# Altium schematic sheet cSLIM-shield.SchDoc
size 297 x 210 mm; SheetNumber: 1; SheetTotal: 12
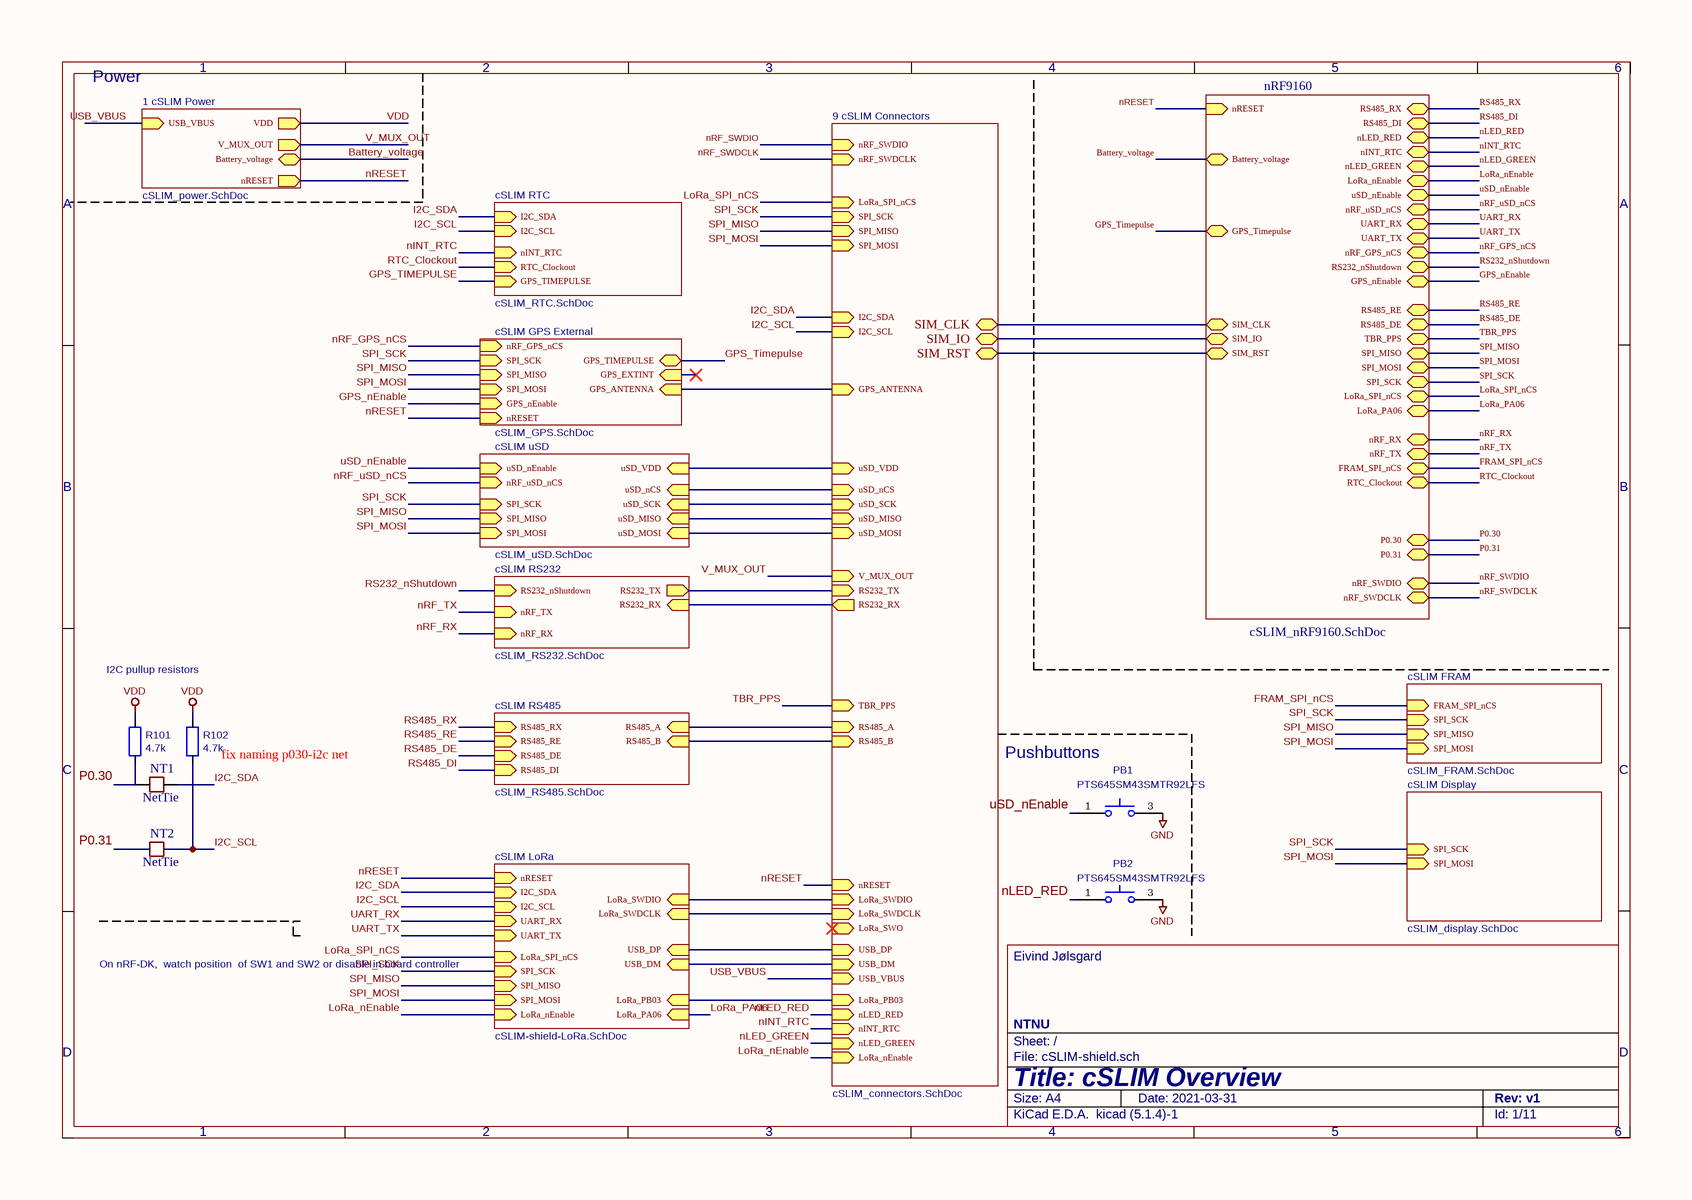
[diagram p0: cSLIM-shield.SchDoc]

## Parts
NT1  NetTie  [NETTIE_FP]
NT2  NetTie  [NETTIE_FP]
PB1  value PTS645SM43SMTR92LFS  [PTS645(SMT)]
PB2  value PTS645SM43SMTR92LFS  [PTS645(SMT)]
R101  4.7k  [RESC1608X55N]
R102  4.7k  [RESC1608X55N]

## Sub-sheets
1 cSLIM Power = cSLIM_power.SchDoc: nRESET (out), VDD (out), USB_VBUS (in), V_MUX_OUT (out), Battery_voltage (bidir)
9 cSLIM Connectors = cSLIM_connectors.SchDoc: RS485_A (in), RS485_B (in), TBR_PPS (in), V_MUX_OUT (in), RS232_TX (in), RS232_RX (out), LoRa_SWDIO (in), LoRa_SWDCLK (in), LoRa_SWO (in), nRESET (in), USB_DM (in), USB_DP (in), USB_VBUS (in), uSD_nCS (in), uSD_MOSI (in), uSD_SCK (in), uSD_MISO (in), uSD_VDD (in), LoRa_SPI_nCS (in), SPI_SCK (in), SPI_MOSI (in), SPI_MISO (in), I2C_SCL (in), I2C_SDA (in), nLED_RED (in), nINT_RTC (in), nLED_GREEN (in), LoRa_nEnable (in), GPS_ANTENNA (in), LoRa_PB03 (in), nRF_SWDIO (in), nRF_SWDCLK (in), SIM_CLK (bidir), SIM_RST (bidir), SIM_IO (bidir)
cSLIM Display = cSLIM_display.SchDoc: SPI_SCK (in), SPI_MOSI (in)
cSLIM FRAM = cSLIM_FRAM.SchDoc: SPI_MISO (in), FRAM_SPI_nCS (in), SPI_SCK (in), SPI_MOSI (in)
cSLIM GPS External = cSLIM_GPS.SchDoc: nRF_GPS_nCS (in), GPS_nEnable (in), SPI_MISO (in), SPI_MOSI (in), SPI_SCK (in), GPS_TIMEPULSE (bidir), GPS_EXTINT (in), nRESET (in), GPS_ANTENNA (in)
cSLIM LoRa = cSLIM-shield-LoRa.SchDoc: I2C_SDA (in), I2C_SCL (in), UART_RX (in), UART_TX (in), USB_DP (in), USB_DM (in), LoRa_SWDIO (in), LoRa_SWDCLK (in), nRESET (in), SPI_MOSI (in), SPI_MISO (in), SPI_SCK (in), LoRa_SPI_nCS (in), LoRa_nEnable (in), LoRa_PB03 (in), LoRa_PA06 (in)
cSLIM RS232 = cSLIM_RS232.SchDoc: RS232_nShutdown (in), RS232_TX (out), RS232_RX (in), nRF_TX (in), nRF_RX (in)
cSLIM RS485 = cSLIM_RS485.SchDoc: RS485_RX (in), RS485_RE (in), RS485_DE (in), RS485_DI (in), RS485_B (in), RS485_A (in)
cSLIM RTC = cSLIM_RTC.SchDoc: I2C_SCL (in), I2C_SDA (in), nINT_RTC (in), RTC_Clockout (in), GPS_TIMEPULSE (in)
cSLIM uSD = cSLIM_uSD.SchDoc: uSD_VDD (in), uSD_MISO (in), uSD_MOSI (in), uSD_SCK (in), uSD_nCS (in), nRF_uSD_nCS (in), uSD_nEnable (in), SPI_MISO (in), SPI_MOSI (in), SPI_SCK (in)
nRF9160 = cSLIM_nRF9160.SchDoc: nRESET (in), RS485_RX (bidir), RS485_DI (bidir), nLED_RED (bidir), nINT_RTC (bidir), nLED_GREEN (bidir), LoRa_nEnable (bidir), uSD_nEnable (bidir), nRF_uSD_nCS (bidir), UART_RX (bidir), UART_TX (bidir), nRF_GPS_nCS (bidir), RS232_nShutdown (bidir), GPS_nEnable (bidir), Battery_voltage (bidir), LoRa_SPI_nCS (bidir), P0.30 (bidir), P0.31 (bidir), RS485_RE (bidir), RS485_DE (bidir), TBR_PPS (bidir), SPI_MISO (bidir), SPI_MOSI (bidir), SPI_SCK (bidir), LoRa_PA06 (bidir), nRF_RX (bidir), nRF_TX (bidir), FRAM_SPI_nCS (bidir), RTC_Clockout (bidir), GPS_Timepulse (bidir), nRF_SWDIO (bidir), nRF_SWDCLK (bidir), SIM_CLK (bidir), SIM_IO (bidir), SIM_RST (bidir)

## Nets
GND: PB1.3 PB2.3
VDD: R101.2 R102.2 ; sheet 1 cSLIM Power/VDD
Battery_voltage: sheet 1 cSLIM Power/Battery_voltage, sheet nRF9160/Battery_voltage
FRAM_SPI_nCS: sheet cSLIM FRAM/FRAM_SPI_nCS, sheet nRF9160/FRAM_SPI_nCS
GPS_nEnable: sheet cSLIM GPS External/GPS_nEnable, sheet nRF9160/GPS_nEnable
GPS_Timepulse: sheet cSLIM GPS External/GPS_TIMEPULSE, sheet cSLIM RTC/GPS_TIMEPULSE, sheet nRF9160/GPS_Timepulse
I2C_SCL: NT2.2 R102.1 ; sheet cSLIM LoRa/I2C_SCL, sheet 9 cSLIM Connectors/I2C_SCL, sheet cSLIM RTC/I2C_SCL
I2C_SDA: sheet cSLIM LoRa/I2C_SDA, sheet 9 cSLIM Connectors/I2C_SDA, sheet cSLIM RTC/I2C_SDA
LoRa_nEnable: sheet cSLIM LoRa/LoRa_nEnable, sheet 9 cSLIM Connectors/LoRa_nEnable, sheet nRF9160/LoRa_nEnable
LoRa_PA06: sheet cSLIM LoRa/LoRa_PA06, sheet nRF9160/LoRa_PA06
LoRa_SPI_nCS: sheet cSLIM LoRa/LoRa_SPI_nCS, sheet 9 cSLIM Connectors/LoRa_SPI_nCS, sheet nRF9160/LoRa_SPI_nCS
nINT_RTC: sheet 9 cSLIM Connectors/nINT_RTC, sheet cSLIM RTC/nINT_RTC, sheet nRF9160/nINT_RTC
nLED_GREEN: sheet 9 cSLIM Connectors/nLED_GREEN, sheet nRF9160/nLED_GREEN
nLED_RED: PB2.1 ; sheet 9 cSLIM Connectors/nLED_RED, sheet nRF9160/nLED_RED
nRESET: sheet cSLIM LoRa/nRESET, sheet 9 cSLIM Connectors/nRESET, sheet 1 cSLIM Power/nRESET, sheet cSLIM GPS External/nRESET, sheet nRF9160/nRESET
nRF_GPS_nCS: sheet cSLIM GPS External/nRF_GPS_nCS, sheet nRF9160/nRF_GPS_nCS
nRF_RX: sheet cSLIM RS232/nRF_RX, sheet nRF9160/nRF_RX
nRF_SWDCLK: sheet 9 cSLIM Connectors/nRF_SWDCLK, sheet nRF9160/nRF_SWDCLK
nRF_SWDIO: sheet 9 cSLIM Connectors/nRF_SWDIO, sheet nRF9160/nRF_SWDIO
nRF_TX: sheet cSLIM RS232/nRF_TX, sheet nRF9160/nRF_TX
nRF_uSD_nCS: sheet cSLIM uSD/nRF_uSD_nCS, sheet nRF9160/nRF_uSD_nCS
P0.30: R101.1 ; sheet nRF9160/P0.30
P0.31: NT2.1 ; sheet nRF9160/P0.31
RS232_nShutdown: sheet cSLIM RS232/RS232_nShutdown, sheet nRF9160/RS232_nShutdown
RS485_DE: sheet cSLIM RS485/RS485_DE, sheet nRF9160/RS485_DE
RS485_DI: sheet cSLIM RS485/RS485_DI, sheet nRF9160/RS485_DI
RS485_RE: sheet cSLIM RS485/RS485_RE, sheet nRF9160/RS485_RE
RS485_RX: sheet cSLIM RS485/RS485_RX, sheet nRF9160/RS485_RX
RTC_Clockout: sheet cSLIM RTC/RTC_Clockout, sheet nRF9160/RTC_Clockout
SPI_MISO: sheet cSLIM LoRa/SPI_MISO, sheet 9 cSLIM Connectors/SPI_MISO, sheet cSLIM uSD/SPI_MISO, sheet cSLIM GPS External/SPI_MISO, sheet cSLIM FRAM/SPI_MISO, sheet nRF9160/SPI_MISO
SPI_MOSI: sheet cSLIM LoRa/SPI_MOSI, sheet 9 cSLIM Connectors/SPI_MOSI, sheet cSLIM uSD/SPI_MOSI, sheet cSLIM Display/SPI_MOSI, sheet cSLIM GPS External/SPI_MOSI, sheet cSLIM FRAM/SPI_MOSI, sheet nRF9160/SPI_MOSI
SPI_SCK: sheet cSLIM LoRa/SPI_SCK, sheet 9 cSLIM Connectors/SPI_SCK, sheet cSLIM uSD/SPI_SCK, sheet cSLIM Display/SPI_SCK, sheet cSLIM GPS External/SPI_SCK, sheet cSLIM FRAM/SPI_SCK, sheet nRF9160/SPI_SCK
TBR_PPS: sheet 9 cSLIM Connectors/TBR_PPS, sheet nRF9160/TBR_PPS
UART_RX: sheet cSLIM LoRa/UART_RX, sheet nRF9160/UART_RX
UART_TX: sheet cSLIM LoRa/UART_TX, sheet nRF9160/UART_TX
USB_VBUS: sheet 9 cSLIM Connectors/USB_VBUS, sheet 1 cSLIM Power/USB_VBUS
uSD_nEnable: PB1.1 ; sheet cSLIM uSD/uSD_nEnable, sheet nRF9160/uSD_nEnable
V_MUX_OUT: sheet 9 cSLIM Connectors/V_MUX_OUT, sheet 1 cSLIM Power/V_MUX_OUT
(unnamed): sheet cSLIM LoRa/USB_DP, sheet 9 cSLIM Connectors/USB_DP
(unnamed): sheet cSLIM LoRa/USB_DM, sheet 9 cSLIM Connectors/USB_DM
(unnamed): sheet cSLIM LoRa/LoRa_SWDIO, sheet 9 cSLIM Connectors/LoRa_SWDIO
(unnamed): sheet cSLIM LoRa/LoRa_SWDCLK, sheet 9 cSLIM Connectors/LoRa_SWDCLK
(unnamed): sheet cSLIM LoRa/LoRa_PB03, sheet 9 cSLIM Connectors/LoRa_PB03
(unnamed): sheet cSLIM RS485/RS485_B, sheet 9 cSLIM Connectors/RS485_B
(unnamed): sheet cSLIM RS485/RS485_A, sheet 9 cSLIM Connectors/RS485_A
(unnamed): sheet cSLIM RS232/RS232_TX, sheet 9 cSLIM Connectors/RS232_TX
(unnamed): sheet cSLIM RS232/RS232_RX, sheet 9 cSLIM Connectors/RS232_RX
(unnamed): sheet 9 cSLIM Connectors/uSD_nCS, sheet cSLIM uSD/uSD_nCS
(unnamed): sheet 9 cSLIM Connectors/uSD_MOSI, sheet cSLIM uSD/uSD_MOSI
(unnamed): sheet 9 cSLIM Connectors/uSD_SCK, sheet cSLIM uSD/uSD_SCK
(unnamed): sheet 9 cSLIM Connectors/uSD_MISO, sheet cSLIM uSD/uSD_MISO
(unnamed): sheet 9 cSLIM Connectors/uSD_VDD, sheet cSLIM uSD/uSD_VDD
(unnamed): sheet 9 cSLIM Connectors/GPS_ANTENNA, sheet cSLIM GPS External/GPS_ANTENNA
(unnamed): sheet 9 cSLIM Connectors/SIM_CLK, sheet nRF9160/SIM_CLK
(unnamed): sheet 9 cSLIM Connectors/SIM_RST, sheet nRF9160/SIM_RST
(unnamed): sheet 9 cSLIM Connectors/SIM_IO, sheet nRF9160/SIM_IO

Not connected (* = marked no-connect by the designer): NT1 1 2

## Notes on the sheet
- Power
- I2C pullup resistors
- (near R102) fix naming p030-i2c net
- (near PB1) Pushbuttons
- On nRF-DK,
  watch position
  of SW1 and SW2 or
  disable in board controller
- 1
- 2
- 3
- 4
- 5
- 6
- A
- B
- C
- Eivind Jølsgard
- D
- Title: cSLIM Overview
- File: cSLIM-shield.sch
- Sheet: /
- NTNU
- KiCad E.D.A.  kicad (5.1.4)-1
- Size: A4
- Date: 2021-03-31
- Rev: v1
- Id: 1/11

## Library data of the parts
PB1 PB2 = PTS645SM43SMTR92LFS: Switch 4-pi. used 1-3 (2-4 not in use); Manufacturer_Name: C & K COMPONENTS; Manufacturer_Part_Number: TLS A 070J LFS; Description_: Tactile Switches Top actuated tact, 0.9 mm travel, 7 N, 50% Tactile, J Leads, SMT, 8.6 x 8.4 x 3.95 mm, Soft Actuator; Footprint: TLSA070JLFS; Supplier: https://www.mouser.ph/datasheet/2/60/tls-1846606.pdf; Mouser Part Number: 611-TLSA070JLFS; Mouser Price/Stock: https://www.mouser.co.uk/ProductDetail/CK/TLS-A-070J-LFS?qs=GedFDFLaBXEdAqJ422mDcw%3D%3D
R101 R102 = R: Value: 4.7k